# Altium schematic sheet Ethernet.SchDoc: Ethernet
size A4; CompanyName: STMicroelectronics; Organization: Microcontrollers Division; DocumentNumber: 7; SheetNumber: 5; SheetTotal: 19
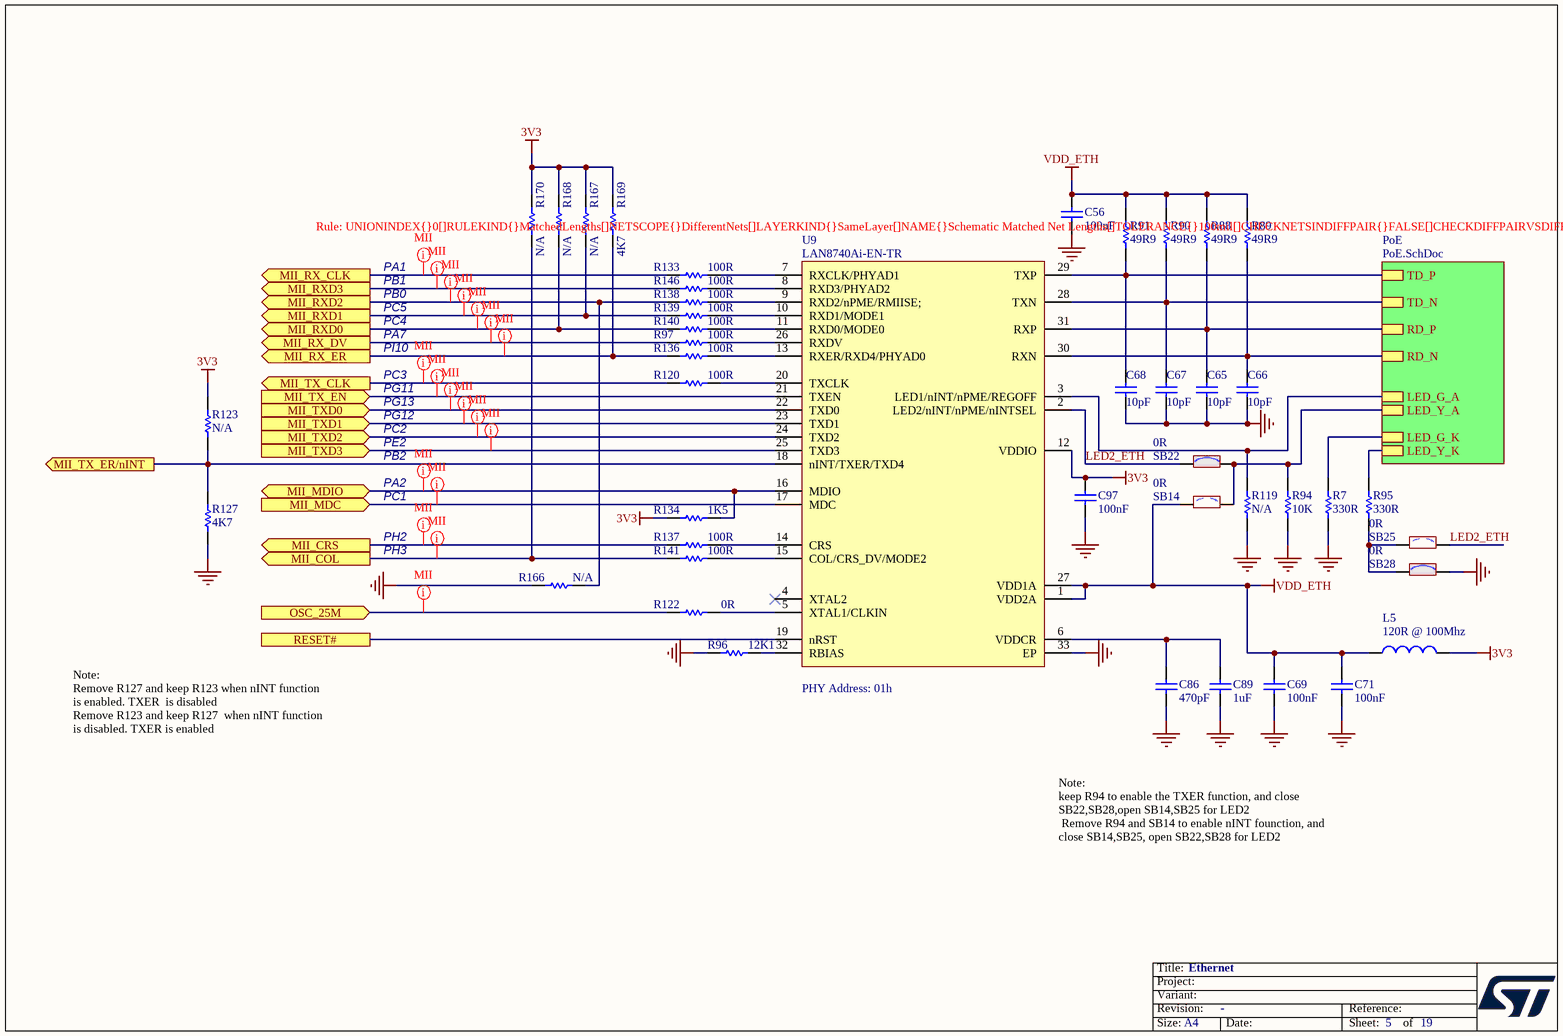
[diagram p0: Ethernet.SchDoc]

## Parts
C56  value 100nF  [C0402]  (hidden comment: Capacitor)
C65  value 10pF  [C0603]  (hidden comment: Capacitor)
C66  value 10pF  [C0603]  (hidden comment: Capacitor)
C67  value 10pF  [C0603]  (hidden comment: Capacitor)
C68  value 10pF  [C0603]  (hidden comment: Capacitor)
C69  value 100nF  [C0402]  (hidden comment: Capacitor)
C71  value 100nF  [C0402]  (hidden comment: Capacitor)
C86  value 470pF  [C0402]  (hidden comment: Capacitor)
C89  value 1uF  [C0603]  (hidden comment: Capacitor)
C97  value 100nF  [C0402]  (hidden comment: Capacitor)
L5  value 120R @ 100Mhz  [FIL_0603_H0P65]  (hidden comment: BEAD)
R7  value 330R  [R0402]  (hidden comment: Resistor)
R88  value 49R9  [R0402]  (hidden comment: Resistor)
R89  value 49R9  [R0402]  (hidden comment: Resistor)
R90  value 49R9  [R0402]  (hidden comment: Resistor)
R91  value 49R9  [R0402]  (hidden comment: Resistor)
R94  value 10K  [R0402]  (hidden comment: Resistor)
R95  value 330R  [R0402]  (hidden comment: Resistor)
R96  value 12K1  [R0402]  (hidden comment: Resistor)
R97  value 100R  [R0402]  (hidden comment: Resistor)
R119  N/A  [R0402]
R120  value 100R  [R0402]  (hidden comment: Resistor)
R122  value 0R  [R0402]  (hidden comment: N/A)
R123  N/A  [R0402]
R127  value 4K7  [R0402]  (hidden comment: Resistor)
R133  value 100R  [R0402]  (hidden comment: Resistor)
R134  value 1K5  [R0603]  (hidden comment: Resistor)
R136  value 100R  [R0402]  (hidden comment: Resistor)
R137  value 100R  [R0402]  (hidden comment: Resistor)
R138  value 100R  [R0402]  (hidden comment: Resistor)
R139  value 100R  [R0402]  (hidden comment: Resistor)
R140  value 100R  [R0402]  (hidden comment: Resistor)
R141  value 100R  [R0402]  (hidden comment: Resistor)
R146  value 100R  [R0402]  (hidden comment: Resistor)
R166  N/A  [R0402]
R167  N/A  [R0402]
R168  N/A  [R0402]
R169  value 4K7  [R0402]  (hidden comment: Resister)
R170  N/A  [R0402]
SB14  value 0R  [SOLDER-BRIDGE_R0603-0R]  (hidden comment: SB_OFF)
SB22  value 0R  [SOLDER-BRIDGE_R0603-0R]  (hidden comment: SB_ON)
SB25  value 0R  [SOLDER-BRIDGE_R0603-0R]  (hidden comment: SB_OFF)
SB28  value 0R  [SOLDER-BRIDGE_R0603-0R]  (hidden comment: SB_ON)
U9  value LAN8740Ai-EN-TR  [ICC_QFN32-EPAD_5X5_P050]

## Sub-sheets
PoE = PoE.SchDoc: LED_G_A, LED_G_K, LED_Y_A, LED_Y_K, RD_P, TD_N, TD_P, RD_N

## Ports
MII_COL (out), MII_CRS (out), MII_MDC (in), MII_MDIO (bidir), MII_RX_CLK (out), MII_RX_DV (out), MII_RX_ER (out), MII_RXD0 (out), MII_RXD1 (out), MII_RXD2 (out), MII_RXD3 (out), MII_TX_CLK (out), MII_TX_EN (in), MII_TX_ER/nINT (out), MII_TXD0 (in), MII_TXD1 (in), MII_TXD2 (in), MII_TXD3 (in), OSC_25M (in), RESET#

## Nets
3V3: C97.1 L5.2 R123.1 R134.2 R167.2 R168.2 R169.2 R170.2 U9.12(VDDIO)
GND: C56.1 C65.1 C66.1 C67.1 C68.1 C69.2 C71.2 C86.1 C89.1 C97.2 R7.1 R94.1 R96.1 R119.2 R127.1 R166.2 SB28.2 U9.33(EP)
VDD_ETH: C56.2 C69.1 C71.1 L5.1 R88.2 R89.2 R90.2 R91.2 SB14.1 U9.1(VDD2A) U9.27(VDD1A)
LED2_ETH: SB22.1 SB25.2 U9.2(LED2/nINT/nPME/nINTSEL)
MII_COL: R141.1 R170.1 ; port MII_COL
MII_CRS: R137.1 ; port MII_CRS
MII_MDC: U9.17(MDC) ; port MII_MDC
MII_MDIO: R134.1 U9.16(MDIO) ; port MII_MDIO
MII_RX_CLK: R133.1 ; port MII_RX_CLK
MII_RX_DV: R97.1 ; port MII_RX_DV
MII_RX_ER: R136.1 R169.1 ; port MII_RX_ER
MII_RXD0: R140.1 R168.1 ; port MII_RXD0
MII_RXD1: R139.1 R167.1 ; port MII_RXD1
MII_RXD2: R138.1 R166.1 ; port MII_RXD2
MII_RXD3: R146.1 ; port MII_RXD3
MII_TX_CLK: R120.1 ; port MII_TX_CLK
MII_TX_EN: U9.21(TXEN) ; port MII_TX_EN
MII_TX_ER/nINT: R123.2 R127.2 U9.18(nINT/TXER/TXD4) ; port MII_TX_ER/nINT
MII_TXD0: U9.22(TXD0) ; port MII_TXD0
MII_TXD1: U9.23(TXD1) ; port MII_TXD1
MII_TXD2: U9.24(TXD2) ; port MII_TXD2
MII_TXD3: U9.25(TXD3) ; port MII_TXD3
OSC_25M: R122.1 ; port OSC_25M
RESET#: U9.19(nRST) ; port RESET#
NetC65_2: C65.2 R88.1 U9.31(RXP) ; sheet PoE/RD_P
NetC66_2: C66.2 R89.1 U9.30(RXN) ; sheet PoE/RD_N
NetC67_2: C67.2 R90.1 U9.28(TXN) ; sheet PoE/TD_N
NetC68_2: C68.2 R91.1 U9.29(TXP) ; sheet PoE/TD_P
NetC86_2: C86.2 C89.2 U9.6(VDDCR)
NetR7_2: R7.2 ; sheet PoE/LED_G_K
NetR94_2: R94.2 SB14.2 SB22.2 ; sheet PoE/LED_Y_A
NetR95_1: R95.1 SB25.1 SB28.1
NetR95_2: R95.2 ; sheet PoE/LED_Y_K
NetR96_2: R96.2 U9.32(RBIAS)
NetR97_2: R97.2 U9.26(RXDV)
NetR119_1: R119.1 U9.3(LED1/nINT/nPME/REGOFF) ; sheet PoE/LED_G_A
NetR120_2: R120.2 U9.20(TXCLK)
NetR122_2: R122.2 U9.5(XTAL1/CLKIN)
NetR133_2: R133.2 U9.7(RXCLK/PHYAD1)
NetR136_2: R136.2 U9.13(RXER/RXD4/PHYAD0)
NetR137_2: R137.2 U9.14(CRS)
NetR138_2: R138.2 U9.9(RXD2/nPME/RMIISE;)
NetR139_2: R139.2 U9.10(RXD1/MODE1)
NetR140_2: R140.2 U9.11(RXD0/MODE0)
NetR141_2: R141.2 U9.15(COL/CRS_DV/MODE2)
NetR146_2: R146.2 U9.8(RXD3/PHYAD2)

Not connected (* = marked no-connect by the designer): U9 4(XTAL2)*

## Layout directives
rule Matched Net Lengths [Tolerance = 100mil]: MII_COL, MII_CRS, MII_MDC, MII_MDIO, MII_RX_CLK, MII_RX_DV, MII_RX_ER, MII_RXD0, MII_RXD1, MII_RXD2, MII_RXD3, MII_TX_CLK, MII_TX_EN, MII_TXD0, MII_TXD1, MII_TXD2, MII_TXD3, OSC_25M

## Notes on the sheet
- PC5
- PB0
- PB1
- PA1
- PC3
- PC4
- PI10
- PA7
- PG11
- PG13
- PG12
- PC2
- PE2
- PC1
- PA2
- PB2
- PH2
- PH3
- (near U9) PHY Address: 01h
- Note:
  Remove R127 and keep R123 when nINT function is enabled. TXER  is disabled
  Remove R123 and keep R127  when nINT function is disabled. TXER is enabled
- Note:
  keep R94 to enable the TXER function, and close SB22,SB28,open SB14,SB25 for LED2
  Remove R94 and SB14 to enable nINT founction, and close SB14,SB25, open SB22,SB28 for LED2
- Title:
- Project:
- Size:
- Revision:
- Variant:
- A4
- -
- Date:
- Reference:
- Sheet:
- of

## Library data of the parts
C56 C69 C71 C97 = MCD-00006: Capacitor, MLCC, 100nF, 16V, X7R, +/-10%, 0402, T=0.5mm; Manufacturer_Part_Number: CC0402KRX7R7BB104; Manufacturer: YAGEO; Part_Preference: Recommended; Partial_Alternate_Internal_Part_Number: MCD-03299; Component_Country_Of_Origin: China; ID: 2474; Order_Code_RS: 9402047; ShowFields: YES; Internal_Part_Number: MCD-00006; Status: Released; Part_Type: Capacitor; Package: 0402; ComponentLink1URL: http://tunmcdsvn.tun.st.com/Component_Documentation_Library/Trunk/Capacitor/YAGEO_X7R_Series; Order_Code_Digikey: 311-1338-1-ND; Order_Code_Farnell: 9402047
C65-C68 = MCD-00637: Capacitor, MLCC, 10pF, 50V, NPO, 5%, 0603, T=0,8mm; Manufacturer_Part_Number: CC0603JRNPO9BN100; Manufacturer: YAGEO; Part_Preference: Recommended; Provided_By: subcon; Initial_Board_Reference: MB1319; Component_Country_Of_Origin: China; ID: 3104; Order_Code_RS: 616-9054; ShowFields: YES; Internal_Part_Number: MCD-00637; Status: Released; Part_Type: Capacitor; Package: 0603; ComponentLink1Description: Yageo_Capacitor_NP0_16V-to-50V.pdf; ComponentLink1URL: http://tunmcdsvn.tun.st.com/Component_Documentation_Library/Trunk/Capacitor/YAGEO_NP0_Series; ECCN_US: n/a; ECCN_EU: n/a; Order_Code_Digikey: 311-1058-1-ND; Order_Code_Farnell: 721967
C86 = MCD-00724: Capacitor, MLCC, 470pF, 50V, NPO, 5%, 0402, T=0,5mm; Manufacturer_Part_Number: CC0402JRNPO9BN471; Manufacturer: YAGEO; Part_Preference: Recommended; Provided_By: Subcon; Initial_Board_Reference: MB1271; Component_Country_Of_Origin: China; ID: 3023; Order_Code_RS: 199-2186; ShowFields: YES; Internal_Part_Number: MCD-00724; Status: Released; Part_Type: Capacitor; Package: 0402; ComponentLink1Description: Yageo_Capacitor_NP0_16V-to-50V.pdf; ComponentLink1URL: http://tunmcdsvn.tun.st.com/Component_Documentation_Library/Trunk/Capacitor/YAGEO_NP0_Series; ECCN_US: n/a; ECCN_EU: n/a; Order_Code_Digikey: 311-1671-1-ND; Order_Code_Farnell: 3366416
C89 = MCD-00010: Capacitor, MLCC, 1uF, 16V, X5R, 10%, 0603, T=0,8mm; Manufacturer_Part_Number: CC0603KRX5R7BB105; Manufacturer: YAGEO; Part_Preference: Recommended; Provided_By: Subcon; Initial_Board_Reference: MB1274; Component_Country_Of_Origin: China; ID: 2470; Order_Code_RS: 2370680; ShowFields: YES; Internal_Part_Number: MCD-00010; Status: Released; Part_Type: Capacitor; Package: 0603; ComponentLink1Description: Yageo_Capacitor_X5R-series.pdf; ComponentLink1URL: http://tunmcdsvn.tun.st.com/Component_Documentation_Library/Trunk/Capacitor/YAGEO_X5R_Series; ECCN_US: n/a; ECCN_EU: n/a; Order_Code_Digikey: 311-1444-1-ND; Order_Code_Farnell: 2370680
L5 = MCD-00306: Bead,120R at 100Mhz,2A,0603; Part_Type: Inductor; Manufacturer_Part_Number: BLM18PG121SN1D; Manufacturer: MURATA; Part_Preference: Recommended; Provided_By: Subcon; Initial_Board_Reference: MB1272; Component_Country_Of_Origin: Japan°°; ID: 2563; Order_Code_RS: 724-1380P; ShowFields: YES; Internal_Part_Number: MCD-00306; Status: Released; ComponentLink1Description: Murata_EMI_Filters_BLM.pdf; ComponentLink1URL: http://tunmcdsvn.tun.st.com/Component_Documentation_Library/Trunk/Inductor/MURATA_BLM_Series; ECCN_US: n/a; ECCN_EU: n/a; Order_Code_Digikey: 490-1037-2-ND; Order_Code_Farnell: 1515738RL; Package: 0603
R7 R95 = MCD-00062: Resistor,330R,0402,1%,1/16W; Manufacturer_Part_Number: RC0402FR-07330RL; Manufacturer: YAGEO; Part_Preference: Recommended; Provided_By: Subcon; Initial_Board_Reference: MB1274; Component_Country_Of_Origin: China; ID: 2529; Order_Code_RS: 9239170; ShowFields: YES; Internal_Part_Number: MCD-00062; Status: Released; Part_Type: Resistor; Package: 0402; ComponentLink1Description: Yageo_Resistor_RC0402-series.pdf; ComponentLink1URL: http://tunmcdsvn.tun.st.com/Component_Documentation_Library/Trunk/Resistor/YAGEO_RC_L_Series; ECCN_US: n/a; ECCN_EU: n/a; Order_Code_Digikey: 311-330LRCT-ND; Order_Code_Farnell: 9239170
R88-R91 = MCD-00565: Resistor,49R9,0402,1%,1/16W; Manufacturer_Part_Number: RC0402FR-0749R9L; Manufacturer: YAGEO; Part_Preference: Recommended; Provided_By: Subcon; Component_Country_Of_Origin: China; ID: 3178; ShowFields: YES; Internal_Part_Number: MCD-00565; Status: Released; Part_Type: Resistor; Package: 0402; ComponentLink1Description: Yageo_Resistor_RC0402-series.pdf; ComponentLink1URL: http://tunmcdsvn.tun.st.com/Component_Documentation_Library/Trunk/Resistor/YAGEO_RC_L_Series; ECCN_US: n/a; ECCN_EU: n/a; Order_Code_Digikey: 311-49.9LRCT-ND; Order_Code_Farnell: 1799218; Order_Code_RS: N/A
R94 R119 = MCD-00053: Resistor,10K,0402,1%,1/16W; Manufacturer_Part_Number: RC0402FR-0710KL; Manufacturer: YAGEO; BMS_Part_Number: 9131590; Part_Preference: Recommended; Provided_By: subcon; Initial_Board_Reference: MB1274; Component_Country_Of_Origin: China; ID: 2539; Order_Code_RS: 9239359; ShowFields: YES; Internal_Part_Number: MCD-00053; Status: Released; Part_Type: Resistor; Package: 0402; ComponentLink1Description: Yageo_Resistor_RC0402-series.pdf; ComponentLink1URL: http://tunmcdsvn.tun.st.com/Component_Documentation_Library/Trunk/Resistor/YAGEO_RC_L_Series; ECCN_US: n/a; ECCN_EU: n/a; Order_Code_Digikey: 311-10.0KLRCT-ND; Order_Code_Farnell: 9239359
  R119: Value: 10K
R96 = MCD-00723: Resistor,12K1,0402,1%,1/16W; Manufacturer_Part_Number: RC0402FR-0712K1L; Manufacturer: YAGEO; Part_Preference: Recommended; Provided_By: Subcon; Initial_Board_Reference: MB1271; Component_Country_Of_Origin: China; ID: 3022; ShowFields: YES; Internal_Part_Number: MCD-00723; Status: Released; Part_Type: Resistor; Package: 0402; ComponentLink1Description: Yageo_Resistor_RC0402-series.pdf; ComponentLink1URL: http://tunmcdsvn.tun.st.com/Component_Documentation_Library/Trunk/Resistor/YAGEO_RC_L_Series; ECCN_US: n/a; ECCN_EU: n/a; Order_Code_Digikey: 311-12.1KLRCT-ND; Order_Code_Farnell: 1799183; Order_Code_RS: N/A
R97 R120 R133 R136-R141 R146 = MCD-00067: Resistor, 100R, 0402, +/- 1%, 1/16W; Manufacturer_Part_Number: RC0402FR-07100RL; Manufacturer: YAGEO; Part_Preference: Recommended; Component_Country_Of_Origin: China; ID: 2527; Order_Code_RS: 9239111; ShowFields: YES; Internal_Part_Number: MCD-00067; Status: Released; Part_Type: Resistor; Package: 0402; ComponentLink1URL: http://tunmcdsvn.tun.st.com/Component_Documentation_Library/Trunk/Resistor/YAGEO_RC_L_Series; Order_Code_Digikey: 311-100LRCT-ND; Order_Code_Farnell: 9239111
R122 = MCD-00052: Resistor,0R,0402,5%,1/16W; Manufacturer_Part_Number: RC0402JR-070RL; Manufacturer: YAGEO; Part_Preference: Recommended; Provided_By: Subcon; Initial_Board_Reference: MB1274; Component_Country_Of_Origin: China; ID: 2540; Order_Code_RS: 9232516RL; ShowFields: YES; Internal_Part_Number: MCD-00052; Status: Released; Part_Type: Resistor; Package: 0402; ComponentLink1Description: Yageo_Resistor_RC0402-series.pdf; ComponentLink1URL: http://tunmcdsvn.tun.st.com/Component_Documentation_Library/Trunk/Resistor/YAGEO_RC_L_Series; ECCN_US: n/a; ECCN_EU: n/a; Order_Code_Digikey: 311-0.0JRCT-ND; Order_Code_Farnell: 9232516RL
R123 R127 R166-R170 = MCD-00065: Resistor,4K7,0402,1%,1/16W; Manufacturer_Part_Number: RC0402FR-074K7L; Manufacturer: YAGEO; Alternate_Manufacturer_Part_Number: RT0402FRE074K7L; Part_Preference: Recommended; Partial_Alternate_Internal_Part_Number: MCD-03300; Provided_By: Subcon; Initial_Board_Reference: mb1274; Component_Country_Of_Origin: China; ID: 2526; Order_Code_RS: 9239316; ShowFields: YES; Internal_Part_Number: MCD-00065; Status: Released; ComponentLink1Description: Yageo_Resistor_RC0402-series.pdf; ECCN_US: n/a; ECCN_EU: n/a; Alternate_Manufacturer: YAGEO; Part_Type: Resistor; Package: 0402; ComponentLink1URL: http://tunmcdsvn.tun.st.com/Component_Documentation_Library/Trunk/Resistor/YAGEO_RC_L_Series; Order_Code_Digikey: 311-4.7KLRCT-ND; Order_Code_Farnell: 9239316
  R123 R166-R168 R170: Value: 4K7
R134 = MCD-00217: Resistor,1K5,0603,1%,1/10W; Manufacturer_Part_Number: RC0603FR-071K5L; Manufacturer: YAGEO; BMS_Part_Number: 9129766; Part_Preference: Recommended; Provided_By: Subcon; Initial_Board_Reference: mb1319; Component_Country_Of_Origin: China; ID: 2651; ShowFields: YES; Internal_Part_Number: MCD-00217; Status: Released; Part_Type: Resistor; Package: 0603; ComponentLink1Description: Yageo_Resistor_RC0603-series.pdf; ComponentLink1URL: http://tunmcdsvn.tun.st.com/Component_Documentation_Library/Trunk/Resistor/YAGEO_RC_L_Series; ECCN_US: n/a; ECCN_EU: n/a; Order_Code_Digikey: 311-1.50KHRCT-ND; Order_Code_Farnell: 9238506; Order_Code_RS: N/A
SB14 SB25 = MCD-00072: Solder Bridge OFF; Part_Type: Resistor; Manufacturer: YAGEO; Manufacturer_HQ_COO: Unknown; Manufacturer_Part_Number: RC0603JR-070RL; Part_Preference: Recommended; Initial_Board_Reference: mb1274; Component_Country_Of_Origin: China; ID: 2520; Order_Code_RS: 199-5647; ShowFields: YES; Internal_Part_Number: MCD-00072; Status: Released; ECCN_US: n/a; ECCN_EU: n/a; Provided_By: n/a; ComponentLink1URL: http://tunmcdsvn.tun.st.com/Component_Documentation_Library/Trunk/Resistor/YAGEO_RC_Series; Order_Code_Digikey: 311-0.0GRTR-ND; Order_Code_Farnell: 2421846; Package: 0603
SB22 SB28 = MCD-00071: Solder Bridge ON; Part_Type: Resistor; Manufacturer: YAGEO; Manufacturer_HQ_COO: Unknown; Manufacturer_Part_Number: RC0603JR-070RL; Part_Preference: Recommended; Provided_By: Subcon; Initial_Board_Reference: mb1274; Component_Country_Of_Origin: China; ID: 2521; Order_Code_RS: 199-5647; ShowFields: YES; Internal_Part_Number: MCD-00071; ECCN_US: n/a; ECCN_EU: n/a; Status: Released; ComponentLink1URL: http://tunmcdsvn.tun.st.com/Component_Documentation_Library/Trunk/Resistor/YAGEO_RC_Series; Order_Code_Digikey: 311-0.0GRTR-ND; Order_Code_Farnell: 2421846; Package: 0603
U9 = MCD-01069: Small Footprint MII/RMII 10/100 Energy Efficient Ethernet / Transceiver with HP Auto-MDIX and flexPWR® Technology; Part_Type: IC; Manufacturer: MICROCHIP; Part_Preference: Recommended; ECCN_US: EAR99; ECCN_EU: NEC; Provided_By: Subcon; Initial_Board_Reference: MB1381; Component_Country_Of_Origin: Unknown; ID: 3417; ShowFields: YES; Internal_Part_Number: MCD-01069; Status: Released; Manufacturer_Part_Number: LAN8740Ai-EN-TR; Package: VQFN-32; ComponentLink1Description: Microchip_PHY_LAN8740Ai-EN-TR.pdf; ComponentLink1URL: http://tunmcdsvn.tun.st.com/Component_Documentation_Library/Trunk/IC/MICROCHIP_LAN8740AI-EN-TR; Order_Code_Digikey: LAN8740AI-EN-TR-ND; Order_Code_Farnell: 2373281; Order_Code_RS: N/A